# Altium schematic sheet LCD.SchDoc
size A
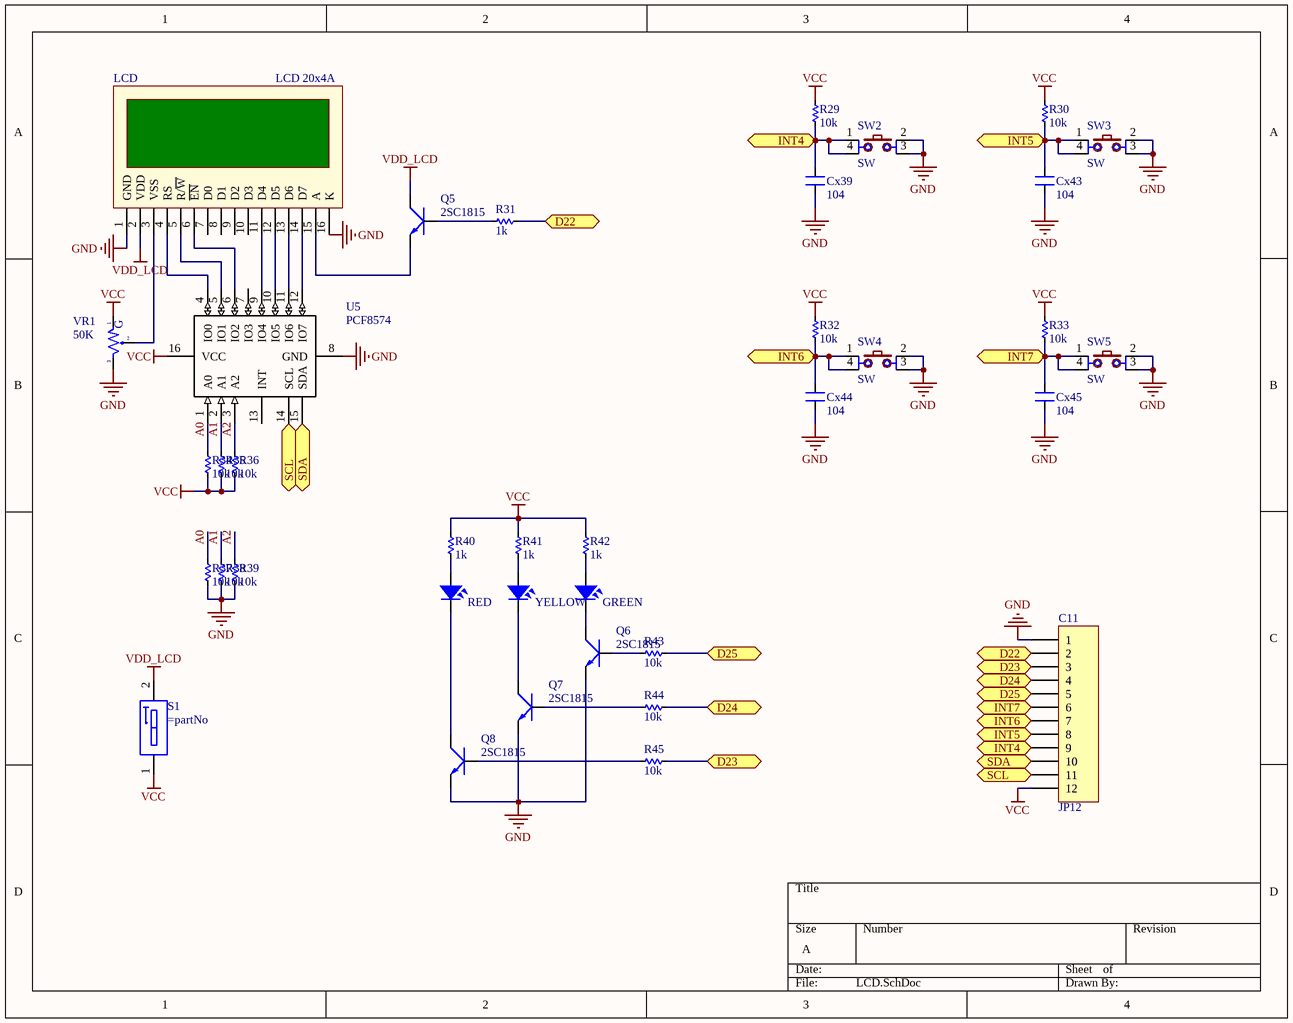
[diagram p0: LCD.SchDoc]

## Parts
C11  JP12  [JP12-D1C]
Cx39  104  [CN-SMD-0805]
Cx43  104  [CN-SMD-0805]
Cx44  104  [CN-SMD-0805]
Cx45  104  [CN-SMD-0805]
GREEN  LED  [LED-5-Green]  (value not drawn)
LCD  LCD 20x4A  [LCD20X4A]
Q5  2SC1815  [SOT23-321]
Q6  2SC1815  [SOT23-321]
Q7  2SC1815  [SOT23-321]
Q8  2SC1815  [SOT23-321]
R29  10k  [RES-SMD-0805]
R30  10k  [RES-SMD-0805]
R31  1k  [RES-SMD-0805]
R32  10k  [RES-SMD-0805]
R33  10k  [RES-SMD-0805]
R34  10k  [RES-SMD-0805]
R35  10k  [RES-SMD-0805]
R36  10k  [RES-SMD-0805]
R37  10k  [RES-SMD-0805]
R38  10k  [RES-SMD-0805]
R39  10k  [RES-SMD-0805]
R40  1k  [RES-SMD-0805]
R41  1k  [RES-SMD-0805]
R42  1k  [RES-SMD-0805]
R43  10k  [RES-SMD-0805]
R44  10k  [RES-SMD-0805]
R45  10k  [RES-SMD-0805]
RED  LED  [LED-5-RED]  (value not drawn)
S1  (no value)  [SW-DIP1]
SW2  SW  [SW2-DIP]
SW3  SW  [SW2-DIP]
SW4  SW  [SW2-DIP]
SW5  SW  [SW2-DIP]
U5  PCF8574  [SO16L]
VR1  50K  [VR-S2]
YELLOW  LED  [LED-5-Yellow]  (value not drawn)

## Ports
D22, D23, D24, D25, INT4, INT5, INT6, INT7, SCL, SDA

## Nets
GND: C11.1 Cx39.1 Cx43.1 Cx44.1 Cx45.1 LCD.1(GND) LCD.16(K) Q6.1(E) Q7.1(E) Q8.1(E) R37.2 R38.2 R39.2 SW2.2 SW2.3 SW3.2 SW3.3 SW4.2 SW4.3 SW5.2 SW5.3 U5.8(GND) VR1.3
VCC: C11.12 R29.2 R30.2 R32.2 R33.2 R34.2 R35.2 R36.2 R40.2 R41.2 R42.2 S1.1 U5.16(VCC) VR1.1
VDD_LCD: LCD.2(VDD) Q5.2(C) S1.2
A0: R34.1 R37.1 U5.1(A0)
A1: R35.1 R38.1 U5.2(A1)
A2: R36.1 R39.1 U5.3(A2)
D22: C11.2 R31.2 ; port D22
D23: C11.3 R45.2 ; port D23
D24: C11.4 R44.2 ; port D24
D25: C11.5 R43.2 ; port D25
INT4: C11.9 Cx39.2 R29.1 SW2.1 SW2.4 ; port INT4
INT5: C11.8 Cx43.2 R30.1 SW3.1 SW3.4 ; port INT5
INT6: C11.7 Cx44.2 R32.1 SW4.1 SW4.4 ; port INT6
INT7: C11.6 Cx45.2 R33.1 SW5.1 SW5.4 ; port INT7
SCL: C11.11 U5.14(SCL) ; port SCL
SDA: C11.10 U5.15(SDA) ; port SDA
NetGREEN_1: GREEN.1 R42.1
NetGREEN_2: GREEN.2 Q6.2(C)
NetLCD_3: LCD.3(VSS) VR1.2
NetLCD_4: LCD.4(RS) U5.4(IO0)
NetLCD_5: LCD.5(R/~{W}) U5.5(IO1)
NetLCD_6: LCD.6(~{EN}) U5.6(IO2)
NetLCD_11: LCD.11(D4) U5.9(IO4)
NetLCD_12: LCD.12(D5) U5.10(IO5)
NetLCD_13: LCD.13(D6) U5.11(IO6)
NetLCD_14: LCD.14(D7) U5.12(IO7)
NetLCD_15: LCD.15(A) Q5.1(E)
NetQ5_3: Q5.3(B) R31.1
NetQ6_3: Q6.3(B) R43.1
NetQ7_2: Q7.2(C) YELLOW.2
NetQ7_3: Q7.3(B) R44.1
NetQ8_2: Q8.2(C) RED.2
NetQ8_3: Q8.3(B) R45.1
NetR40_1: R40.1 RED.1
NetR41_1: R41.1 YELLOW.1

Not connected (* = marked no-connect by the designer): LCD 7(D0) 8(D1) 9(D2) 10(D3); U5 7(IO3) 13(INT)

## Notes on the sheet
- (in symbol VR-S) G

## Library data of the parts
C11 = JP12: WR-PHD 2.54 mm Angled Socket Header; Manufacturer: W¨¹rth Elektronik eiSos GmbH; partNo: 613012143121; ComponentLink1 Description: Manufacturer; ComponentLink2 Description: Datasheet; NoPins: 12; Created Date: 29 March 2013; ComponentLink1URL: http://www.we-online.com; ComponentLink2URL: http://katalog.we-online.de/em/datasheet/6130xx143121.pdf; Created by: Karrer Zheng
Cx39 Cx43-Cx45 = CN: Value: 33pF
GREEN RED YELLOW = LED: LED Single colour Green and Red; Value: LED 3 ly Single Colour
LCD = LCD20x4A: LCD dipslay 20 char, 4 line; Value: Jum 40; Value: LCD 20x4A
Q5-Q8 = 2SC1815: NPN 600mW, ECB; Value: C1815
R29-R45 = Res-SMD: Resistor; Manufacturer: Generic Components; Class: Passive; Published: 08/06/2000; Publisher: Altium Hobart Technology Centre
S1 = SWDIP1: WS-DITV 2.54 mm small compact THT flat actuator with top tape; Manufacturer: Wurth Elektronik; Part No.: 418127160901; ComponentLink1 Description: Manufacturer; ComponentLink2 Description: Datasheet; Pole: 01; Created Date: Dec.2015; ComponentLink1URL: http://www.we-online.com; ComponentLink2URL: http://katalog.we-online.de/em/datasheet/4181271609xx.pdf; Created by: Baojun Chen
SW2-SW5 = SW4: Switch button 4 pin; Value: Button chip 4 pin
U5 = PCF8574: I2C PORT EXPANDER; Manufacturer Part Number: PCF8574T/3,512; Manufacturer: NXP Semiconductors; Includes: POR; Interface: I²C; Interrupt Output: Yes; Number of I /O: 8; Voltage - Supply: 2.5 V ~ 6 V; Frequency - Clock: 100KHz; Supplier 1: Digi-Key; Supplier Part Number 1: 568-1076-5-ND; Package / Case: 16-SOIC (7.5mm Width); Category: Integrated Circuits (ICs); Supplier Part Number: 568-1076-5-ND; Operating Temperature: -40°C ~ 85°C; Packaging: Tube; RoHS: RoHS Compliant; Supplier: Digi-Key
VR1 = VR-S: Var Resistor; Value: Volume 50k